# Altium schematic sheet Enkoder.SchDoc
size A2; SheetNumber: 1; SheetTotal: 1
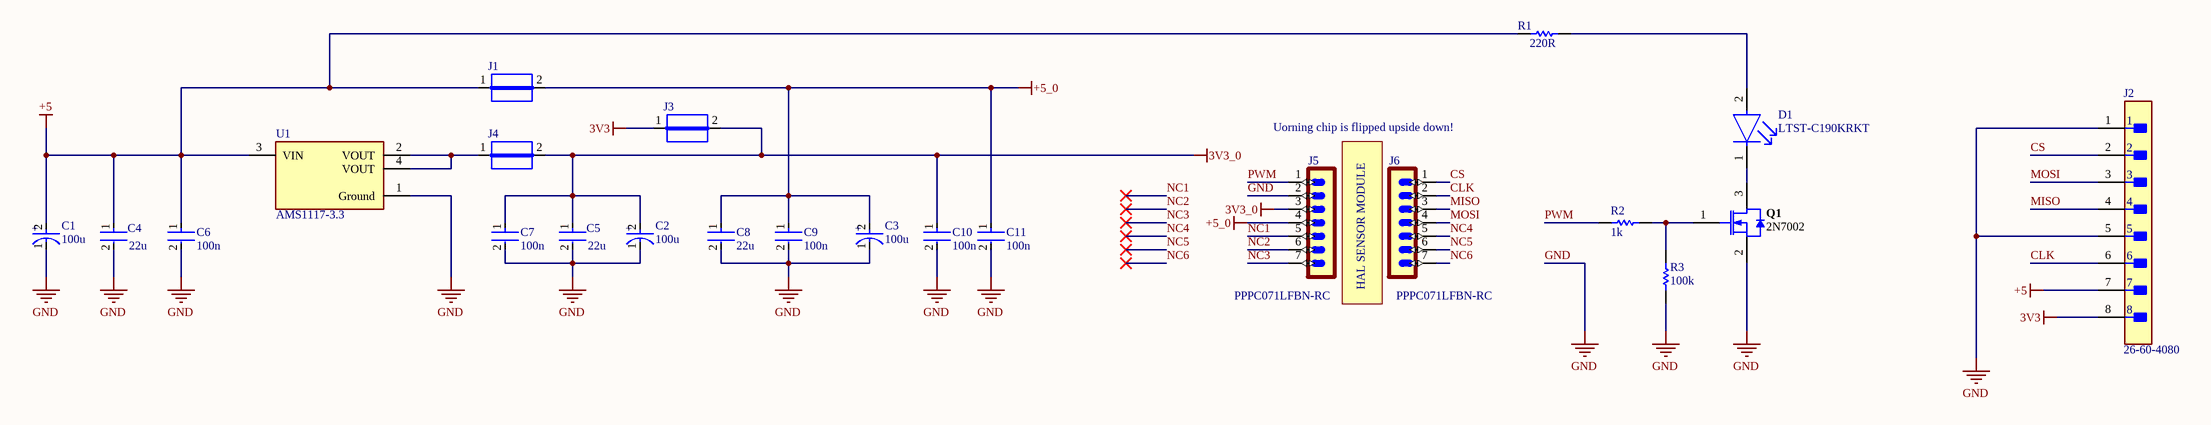
[diagram p0: Enkoder.SchDoc]

## Parts
C1  100u  [FP-FTF-MFG]
C2  100u  [FP-FTF-MFG]
C3  100u  [FP-FTF-MFG]
C4  22u  [FP-C3216-085-0_2-MFG]
C5  22u  [FP-C3216-085-0_2-MFG]
C6  100n  [FP-C0603C-CF-MFG]
C7  100n  [FP-C0603C-CF-MFG]
C8  22u  [FP-C3216-085-0_2-MFG]
C9  100n  [FP-C0603C-CF-MFG]
C10  100n  [FP-C0603C-CF-MFG]
C11  100n  [FP-C0603C-CF-MFG]
D1  LTST-C190KRKT  [FP-LTST-C190KRKT-MFG]
J1  JUMPER  [JUMPER]  (value not drawn)
J2  26-60-4080  [FP-26-60-4080-MFG]
J3  JUMPER  [JUMPER]  (value not drawn)
J4  JUMPER  [JUMPER]  (value not drawn)
J5  PPPC071LFBN-RC  [1X07-PIN]
J6  PPPC071LFBN-RC  [1X07-PIN]
Q1  2N7002  [INF-PG-SOT23_M]
R1  220R  [RESC0603(1608)_N]
R2  1k  [RESC0603(1608)_N]
R3  100k  [RESC0603(1608)_N]
U1  AMS1117-3.3  [FP-AMS1117-IPC_C]

## Nets
3V3: J2.8 J3.1
3V3_0: C2.2(A) C5.1 C7.1 C10.1 J3.2 J4.2 J5.3(P$3)
+5: C1.2(A) C4.1 C6.1 J1.1 J2.7 R1.2 U1.3(VIN)
+5_0: C3.2(A) C8.1 C9.1 C11.1 J1.2 J5.4(P$4)
GND: C1.1(C) C2.1(C) C3.1(C) C4.2 C5.2 C6.2 C7.2 C8.2 C9.2 C10.2 C11.2 J2.1 J2.5 J5.2(P$2) Q1.2(SOURCE) R3.2 U1.1(Ground)
CLK: J2.6 J6.2(P$2)
CS: J2.2 J6.1(P$1)
MISO: J2.4 J6.3(P$3)
MOSI: J2.3 J6.4(P$4)
NC1: J5.5(P$5)
NC2: J5.6(P$6)
NC3: J5.7(P$7)
NC4: J6.5(P$5)
NC5: J6.6(P$6)
NC6: J6.7(P$7)
PWM: J5.1(P$1) R2.2
NetD1_1: D1.1(C) Q1.3(DRAIN)
NetD1_2: D1.2(A) R1.1
NetJ4_1: J4.1 U1.2(VOUT) U1.4(VOUT)
NetQ1_1: Q1.1(GATE) R2.1 R3.1

## Notes on the sheet
- Uorning chip is flipped upside down!
- HAL SENSOR MODULE
- (in symbol CMP-05427-000092-1) +

## Library data of the parts
C1-C3 = CMP-05427-000092-1: CAP ALUM 220UF 20% 50V SMD; Ripple Current (AC): 670mA; Dielectric Material: Aluminium; Life (Hours): 2000Hour; Leakage Current: 110uA; Lead Diameter: 0.9mm; ESR (Equivalent Series Resistance): 180mR; REACH SVHC: No SVHC; Voltage Rating (DC): 50V; Radiation Hardening: No; Capacitance: 220uF; Length: 10.2mm; Construction: Cylindrical; Case/Package: Radial; Series: FT; Lead Free: Lead Free; Voltage Rating: 50V; Tolerance: 20%; Contact Plating: Tin; Number of Pins: 2; Height - Seated (Max): 0.413inch; RoHS Compliant: Yes; Diameter: 8mm; Ripple Current: 670mA; Lead Pitch: 3.1mm; Termination: SMD/SMT; Mount: Surface Mount; Min Operating Temperature: -55°C; Max Operating Temperature: 105°C; Voltage: 50V; Height: 10.2mm; Package Quantity: 500; Packaging: Tape and Reel
C4 C5 C8 = CMP-08246-004858-1: Multilayer Ceramic Capacitors 22μF ±20% 6.3V X5R SMD 1206; Capacitance: 22uF; RoHS Compliant: Yes; Case/Package: 1206; Length: 0.126inch; Thickness: 0.037inch; Min Operating Temperature: -55°C; REACH SVHC: No SVHC; Number of Pins: 2; Weight: 0.000571oz; Resistor Type: Ceramic; Dielectric: X5R; Tolerance: 20%; Max Operating Temperature: 85°C; Package Quantity: 1; Series: C; Depth: 1.6mm; Width: 0.063inch; Lead Free: Lead Free; Dielectric Material: Ceramic; Case Code (Imperial): 1206; Mount: Surface Mount; Voltage Rating: 6.3V; Voltage Rating (DC): 6.3V; Case Code (Metric): 3216; Height: 0.85mm; Packaging: Cut Tape; Termination: SMD/SMT
C6 C7 C9-C11 = CMP-2006-03061-2: CAP CER 0.1UF 50V X7R 0603; Manufacturer: KEMET; Manufacturer Part Number: C0603C104K5RACTU; Tolerance: 0.1; Temperature Coefficient: 30ppm/°C; Material: Ceramic; Automotive Grade: Grade 1; Value: 0.10 μF; Temperature: -55°C to +125°C; RoHS: TRUE; Temperature Range High: +125°C; Lead Free: Yes; Octopart: https://octopart.com/c0603c104k5ractu-kemet-139244; Digikey Description: CAP CER 0.1UF 50V X7R 0603; Category: Cap; Package: C0603C-CF; ComponentLink2Description: Datasheet; Temperature Range Low: -55°C; Device Class L1: Passive Components; Voltage Rating: 50 V; Automotive: Yes; Device Class L3: Ceramic Capacitors; ComponentLink2URL: https://api.kemet.com/component-edge/download/datasheet/C0603C100J5GACAUTO.pdf; Capacitance: 0.10 μF; Device Class L2: Capacitors; Temperature Characteristic: X7R; Height: 0.87mm
D1 = CMP-1674-00011-2: LED RED CLEAR CHIP SMD; Reverse Voltage: 5V; Viewing Angle: 130°; Power Rating: 75mW; Test Current: 20mA; Number of Elements: 1; Lens Color: Colorless; Wavelength: 639nm; Dominant Wavelength: 631nm; Lens Style: Diffused; Forward Current: 30mA; Forward Voltage: 2.4V; Luminous Intensity: 54mcd; Color: Red; Case Code (Imperial): 0603; Lens Transparency: Clear; Lead Free: Lead Free; Package Quantity: 1; Packaging: Tape and Reel; Max Operating Temperature: 85°C; Number of Pins: 2; Height: 0.8mm; Case/Package: 0603; Number of LEDs: 1; Width: 0.8mm; Case Code (Metric): 1608; Depth: 0.8mm; Mount: Surface Mount; Radiation Hardening: No; Length: 1.6mm; Illumination Color: Red; Power Dissipation: 75mW; Min Operating Temperature: -55°C
J1 J3 J4 = CMP-009-00061-2: Pins: 2
J2 = CMP-00257-00111878-1: 26-60-4080 3.96mm (.156") Pitch KK® Solid Header, Vertical, Friction Lock, 8 Circuits, Tin (Sn) Plating; Manufacturer Lifecycle Status: ACTIVE; NexarPartId: 111878; Contact Resistance: 6mΩ; Voltage Rating: 250V; Gender: Male; Number of Positions: 8; Number of Lines: 1; Approvals: CSA, UL; Insulation Resistance: 50GΩ; Current Rating: 7A; Glow Wire Compliant: Non-compliant; Orientation: Vertical; Contact Gender: Male; Voltage Rating (AC): 250V; Radiation Hardening: No; Number of Contacts: 8; Height: 14.73mm; Max Operating Temperature: 75°C; Number of Rows: 1; RoHS: Compliant; REACH SVHC: Unknown; Packaging: Bulk; Color: Natural; Number of Circuits: 8; Pitch: 3.96mm; Depth: 10.01mm; Voltage Rating (DC): 250V; Housing Color: Natural; Lead Free: Lead Free; Plating: Tin; Country of Origin: US; Number of Pins: 8; Material: Polyester; Mount: Through Hole; Lifecycle Status: Production; Termination: Solder; Number of Poles: 8; Length: 31.55mm; Max Voltage Rating (AC): 250V; Contact Plating: Tin; Contact Material: Brass, Tin; Schedule B: 8536694040; Flammability Rating: UL94 V-0; Max Current Rating: 7A; Lead Pitch: 3.96mm; Housing Material: Polyester; Min Operating Temperature: -40°C
J5 J6 = CMP-002-00071-1: 7 Position Header Connector 0.100 (2.54mm) Through Hole Gold; MF: Sullins Connector; Component Type: Standard; Availability: In Stock; Pins: 7; Purchase-URL: https://pricing.snapeda.com/search?q=PPPC071LFBN-RC&ref=eda; Source: PPPC071LFBN-RC.SchLib; MP: PPPC071LFBN-RC; Price: None; SnapEDA_Link: https://www.snapeda.com/parts/PPPC071LFBN-RC/Sullins+Connector+Solutions/view-part/?ref=snap; Case/Package: None; Value: *; Design Item ID: PPPC071LFBN-RC; Check_prices: https://www.snapeda.com/parts/PPPC071LFBN-RC/Sullins+Connector+Solutions/view-part/?ref=eda
Q1 = CMP-1149-00026-1: N-Channel OptiMOS Small-Signal-Transistor, 60 V VDS, 0.3 A ID, -55 to 150 degC, PG-SOT23, Reel, Green; Manufacturer: Infineon; RDS (on) (max) (@4.5V): 4,000 mOhm; VDS (max): 60 V; IDpuls (max): 1.2Â A; QG: 0.4Â nC; RDS (on) (max): 3,000 mOhm; RthJA (max): 250 K/W; ID (max): 0.3Â A; VGS(th) (max): 2.5Â V; VGS(th) (min): 1.5Â V; Green: TRUE; Ptot (max): 0.5Â W; PackageDescription: 3-Pin Small Outline Transistor Package, 2.9 x 1.3 mm Body, 0.95 mm Pitch; Halogen-free: TRUE; ComponentLink2Description: Datasheet; ComponentLink1URL: http://www.infineon.com/; Packing: Reel; DatasheetVersion: Rev. 2.4; PartNumber: 2N7002; PackageReference: PG-SOT23; PackageVersion: Apr-08; ComponentLink3URL: http://www.infineon.com/dgdl/SOT23-Package_Overview.pdf?folderId=db3a30431936bc4b0119532290053c66&fileId=db3a30431936bc4b0119533468123c85; ComponentLink1Description: Manufacturer URL; Mounting Technology: Surface Mount; ComponentLink3Description: Package Specification; ComponentLink2URL: http://www.infineon.com/dgdl/2N7002_Rev2.4.pdf?folderId=db3a3043156fd573011622e10b5c1f67&fileId=db3a304319bc939a0119c2a9461e79e6
R1 = CMP-1012-00081-1: 0.1W 1% 0603 (1608 Metric)  SMD; Tolerance: 5 %; Case-Metric: 1608; Value: 2000.00 Ohm; Case-EIA: 0603; Technology: SMT; Power: 0.1 W
R2 R3 = CMP-1012-00081-1: 2K 0.1W 5% 0603 (1608 Metric)  SMD; Case-Metric: 1608; Value: 2000.00 Ohm; Case-EIA: 0603; Tolerance: 5 %; Technology: SMT; Power: 0.1 W
U1 = CMP-209535-000001-1: LDO Voltage Regulators 1A, 3.3V; Manufacturer: Advanced Monolithic Systems; Dropout Voltage: 1.1V; Output Type: Fixed; Nominal Supply Current: 5mA; Max Power Dissipation: 1.2W; Max Supply Voltage: 15V; Number Of Outputs: 1; Standoff Height: 0.64mm; Max Junction Temp: +125°C; Height: 1.8mm; Package: AMS1117; Device Class L2: Power Management ICs; ComponentLink2Description: Datasheet; ComponentLink2URL: http://www.advanced-monolithic.com/pdf/ds1117.pdf; Category: IC; RoHS: TRUE; Automotive: No; Device Class L1: Integrated Circuits (ICs); Output Current: 1A; Device Class L3: Voltage Regulators - Linear; Temperature: -40°C to +125°C; Output Voltage: 3.3V; Manufacturer Part Number: AMS1117-3.3; Temperature Range Low: -40°C; Octopart: https://octopart.com/ams1117-3.3-advanced+monolithic+systems-25899300; Lead Free: Yes; Ipc Land Pattern Name: SOT229P700X180-4; Temperature Range High: +125°C